# Altium schematic sheet MCU.SchDoc: ESP32 SoC
size 420 x 297 mm; SheetNumber: 9
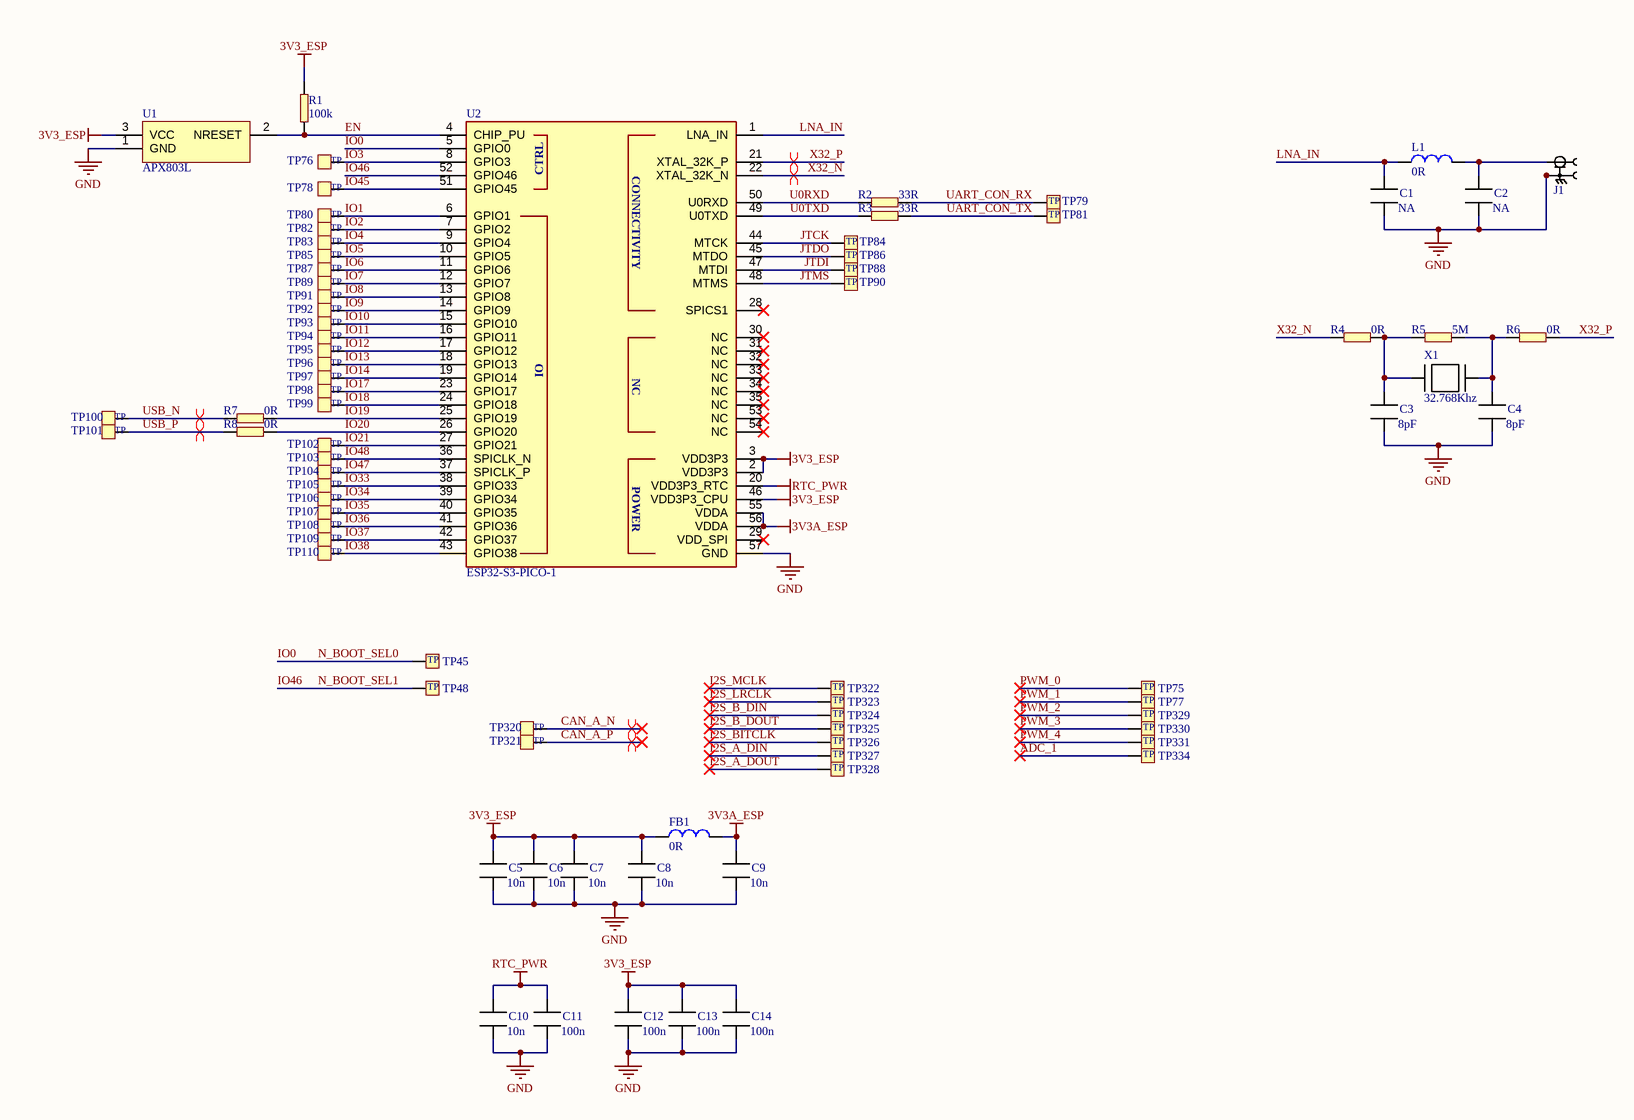
[diagram p0: MCU.SchDoc]

## Parts
C1  value NA  [CAPC0603X03L]  (hidden comment: ERP_102-1)  (no BOM)
C2  value NA  [CAPC0603X03L]  (hidden comment: ERP_102-1)  (no BOM)
C3  value 8pF  [CAPC0603X03L]  (hidden comment: ERP_102-1)  (no BOM)
C4  value 8pF  [CAPC0603X03L]  (hidden comment: ERP_102-1)  (no BOM)
C5  value 10n  [CAPC0603X03L]  (hidden comment: ERP_102-1)
C6  value 10n  [CAPC0603X03L]  (hidden comment: ERP_102-1)
C7  value 10n  [CAPC0603X03L]  (hidden comment: ERP_102-1)
C8  value 10n  [CAPC0603X03L]  (hidden comment: ERP_102-1)
C9  value 10n  [CAPC0603X03L]  (hidden comment: ERP_102-1)
C10  value 10n  [CAPC0603X03L]  (hidden comment: ERP_102-1)
C11  value 100n  [CAPC0603X03L]  (hidden comment: ERP_102-1)
C12  value 100n  [CAPC0603X03L]  (hidden comment: ERP_102-1)
C13  value 100n  [CAPC0603X03L]  (hidden comment: ERP_102-1)
C14  value 100n  [CAPC0603X03L]  (hidden comment: ERP_102-1)
FB1  value 0R  [INDC0603X03L]  (hidden comment: ERP_103-3)
J1  ERP_148-1  [uFL_50R]  (value not drawn)
L1  value 0R  [IND_0603]  (hidden comment: ERP_103-3)
R1  value 100k  [RESC0603X03L]  (hidden comment: ERP_101-1)
R2  value 33R  [RESC0603X03L]  (hidden comment: ERP_101-1)
R3  value 33R  [RESC0603X03L]  (hidden comment: ERP_101-1)
R4  value 0R  [RESC0603X03L]  (hidden comment: ERP_101-1)
R5  value 5M  [RESC0603X03L]  (hidden comment: ERP_101-1)  (no BOM)
R6  value 0R  [RESC0603X03L]  (hidden comment: ERP_101-1)
R7  value 0R  [RESC0603X03L]  (hidden comment: ERP_101-1)
R8  value 0R  [RESC0603X03L]  (hidden comment: ERP_101-1)
TP45  TP_0P8MM  [TP_0P8MM]  (value not drawn)  (no BOM)
TP48  TP_0P8MM  [TP_0P8MM]  (value not drawn)  (no BOM)
TP75  TP_0P8MM  [TP_0P8MM]  (value not drawn)  (no BOM)
TP76  TP_0P8MM  [TP_0P8MM]  (value not drawn)  (no BOM)
TP77  TP_0P8MM  [TP_0P8MM]  (value not drawn)  (no BOM)
TP78  TP_0P8MM  [TP_0P8MM]  (value not drawn)  (no BOM)
TP79  TP_0P8MM  [TP_0P8MM]  (value not drawn)  (no BOM)
TP80  TP_0P8MM  [TP_0P8MM]  (value not drawn)  (no BOM)
TP81  TP_0P8MM  [TP_0P8MM]  (value not drawn)  (no BOM)
TP82  TP_0P8MM  [TP_0P8MM]  (value not drawn)  (no BOM)
TP83  TP_0P8MM  [TP_0P8MM]  (value not drawn)  (no BOM)
TP84  TP_0P8MM  [TP_0P8MM]  (value not drawn)  (no BOM)
TP85  TP_0P8MM  [TP_0P8MM]  (value not drawn)  (no BOM)
TP86  TP_0P8MM  [TP_0P8MM]  (value not drawn)  (no BOM)
TP87  TP_0P8MM  [TP_0P8MM]  (value not drawn)  (no BOM)
TP88  TP_0P8MM  [TP_0P8MM]  (value not drawn)  (no BOM)
TP89  TP_0P8MM  [TP_0P8MM]  (value not drawn)  (no BOM)
TP90  TP_0P8MM  [TP_0P8MM]  (value not drawn)  (no BOM)
TP91  TP_0P8MM  [TP_0P8MM]  (value not drawn)  (no BOM)
TP92  TP_0P8MM  [TP_0P8MM]  (value not drawn)  (no BOM)
TP93  TP_0P8MM  [TP_0P8MM]  (value not drawn)  (no BOM)
TP94  TP_0P8MM  [TP_0P8MM]  (value not drawn)  (no BOM)
TP95  TP_0P8MM  [TP_0P8MM]  (value not drawn)  (no BOM)
TP96  TP_0P8MM  [TP_0P8MM]  (value not drawn)  (no BOM)
TP97  TP_0P8MM  [TP_0P8MM]  (value not drawn)  (no BOM)
TP98  TP_0P8MM  [TP_0P8MM]  (value not drawn)  (no BOM)
TP99  TP_0P8MM  [TP_0P8MM]  (value not drawn)  (no BOM)
TP100  TP_0P8MM  [TP_0P8MM]  (value not drawn)  (no BOM)
TP101  TP_0P8MM  [TP_0P8MM]  (value not drawn)  (no BOM)
TP102  TP_0P8MM  [TP_0P8MM]  (value not drawn)  (no BOM)
TP103  TP_0P8MM  [TP_0P8MM]  (value not drawn)  (no BOM)
TP104  TP_0P8MM  [TP_0P8MM]  (value not drawn)  (no BOM)
TP105  TP_0P8MM  [TP_0P8MM]  (value not drawn)  (no BOM)
TP106  TP_0P8MM  [TP_0P8MM]  (value not drawn)  (no BOM)
TP107  TP_0P8MM  [TP_0P8MM]  (value not drawn)  (no BOM)
TP108  TP_0P8MM  [TP_0P8MM]  (value not drawn)  (no BOM)
TP109  TP_0P8MM  [TP_0P8MM]  (value not drawn)  (no BOM)
TP110  TP_0P8MM  [TP_0P8MM]  (value not drawn)  (no BOM)
TP320  TP_0P8MM  [TP_0P8MM]  (value not drawn)  (no BOM)
TP321  TP_0P8MM  [TP_0P8MM]  (value not drawn)  (no BOM)
TP322  TP_0P8MM  [TP_0P8MM]  (value not drawn)  (no BOM)
TP323  TP_0P8MM  [TP_0P8MM]  (value not drawn)  (no BOM)
TP324  TP_0P8MM  [TP_0P8MM]  (value not drawn)  (no BOM)
TP325  TP_0P8MM  [TP_0P8MM]  (value not drawn)  (no BOM)
TP326  TP_0P8MM  [TP_0P8MM]  (value not drawn)  (no BOM)
TP327  TP_0P8MM  [TP_0P8MM]  (value not drawn)  (no BOM)
TP328  TP_0P8MM  [TP_0P8MM]  (value not drawn)  (no BOM)
TP329  TP_0P8MM  [TP_0P8MM]  (value not drawn)  (no BOM)
TP330  TP_0P8MM  [TP_0P8MM]  (value not drawn)  (no BOM)
TP331  TP_0P8MM  [TP_0P8MM]  (value not drawn)  (no BOM)
TP334  TP_0P8MM  [TP_0P8MM]  (value not drawn)  (no BOM)
U1  APX803L  [APX803L]
U2  value ESP32-S3-PICO-1  [QFN40P700X700X106_HS-57N]  (hidden comment: ERP_121-4)
X1  value 32.768Khz  [CRYS_L1.6_W1]  (hidden comment: ERP_111-1)

## Nets
3V3_ESP: C5.1 C6.1 C7.1 C8.1 C12.1 C13.1 C14.1 FB1.1 R1.2 U1.3(VCC) U2.2(VDD3P3) U2.3(VDD3P3) U2.46(VDD3P3_CPU)
3V3A_ESP: C9.1 FB1.2 U2.55(VDDA) U2.56(VDDA)
GND: C1.2 C2.2 C3.2 C4.2 C5.2 C6.2 C7.2 C8.2 C9.2 C10.2 C11.2 C12.2 C13.2 C14.2 J1.2 J1.3 U1.1(GND) U2.57(GND)
RTC_PWR: C10.1 C11.1 U2.20(VDD3P3_RTC)
ADC_1: TP334.1
CAN_A_N: TP320.1
CAN_A_P: TP321.1
EN: R1.1 U1.2(NRESET) U2.4(CHIP_PU)
I2S_A_DIN: TP327.1
I2S_A_DOUT: TP328.1
I2S_B_DIN: TP324.1
I2S_B_DOUT: TP325.1
I2S_BITCLK: TP326.1
I2S_LRCLK: TP323.1
I2S_MCLK: TP322.1
IO0: TP45.1 U2.5(GPIO0)  [also labelled N_BOOT_SEL0]
IO1: TP80.1 U2.6(GPIO1)
IO2: TP82.1 U2.7(GPIO2)
IO3: TP76.1 U2.8(GPIO3)
IO4: TP83.1 U2.9(GPIO4)
IO5: TP85.1 U2.10(GPIO5)
IO6: TP87.1 U2.11(GPIO6)
IO7: TP89.1 U2.12(GPIO7)
IO8: TP91.1 U2.13(GPIO8)
IO9: TP92.1 U2.14(GPIO9)
IO10: TP93.1 U2.15(GPIO10)
IO11: TP94.1 U2.16(GPIO11)
IO12: TP95.1 U2.17(GPIO12)
IO13: TP96.1 U2.18(GPIO13)
IO14: TP97.1 U2.19(GPIO14)
IO17: TP98.1 U2.23(GPIO17)
IO18: TP99.1 U2.24(GPIO18)
IO19: R7.1 U2.25(GPIO19)
IO20: R8.1 U2.26(GPIO20)
IO21: TP102.1 U2.27(GPIO21)
IO33: TP105.1 U2.38(GPIO33)
IO34: TP106.1 U2.39(GPIO34)
IO35: TP107.1 U2.40(GPIO35)
IO36: TP108.1 U2.41(GPIO36)
IO37: TP109.1 U2.42(GPIO37)
IO38: TP110.1 U2.43(GPIO38)
IO45: TP78.1 U2.51(GPIO45)
IO46: TP48.1 U2.52(GPIO46)  [also labelled N_BOOT_SEL1]
IO47: TP104.1 U2.37(SPICLK_P)
IO48: TP103.1 U2.36(SPICLK_N)
JTCK: TP84.1 U2.44(MTCK)
JTDI: TP88.1 U2.47(MTDI)
JTDO: TP86.1 U2.45(MTDO)
JTMS: TP90.1 U2.48(MTMS)
LNA_IN: C1.1 L1.1 U2.1(LNA_IN)
PWM_0: TP75.1
PWM_1: TP77.1
PWM_2: TP329.1
PWM_3: TP330.1
PWM_4: TP331.1
U0RXD: R2.2 U2.50(U0RXD)
U0TXD: R3.2 U2.49(U0TXD)
UART_CON_RX: R2.1 TP79.1
UART_CON_TX: R3.1 TP81.1
USB_N: R7.2 TP100.1
USB_P: R8.2 TP101.1
X32_N: R4.2 U2.22(XTAL_32K_N)
X32_P: R6.1 U2.21(XTAL_32K_P)
NetC2_1: C2.1 J1.1 L1.2
NetC3_1: C3.1 R4.1 R5.2 X1.1
NetC4_1: C4.1 R5.1 R6.2 X1.2

Not connected (* = marked no-connect by the designer): U2 28(SPICS1)* 29(VDD_SPI)* 30(NC)* 31(NC)* 32(NC)* 33(NC)* 34(NC)* 35(NC)* 53(NC)* 54(NC)*

## Layout directives
differential pair: CAN_A_N, CAN_A_P, USB_N, USB_P, X32_N, X32_P

## Notes on the sheet
- PROJECT
- SIZE
- FILE NAME
- A3
- TITLE
- SHEET
- OF
- REV
- (in symbol ESP32-S3-PICO-1) CTRL; CONNECTIVITY; IO; POWER
- (in symbol TP_0P8MM) TP

## Library data of the parts
C1-C14 = MLCC_0201: Chip Capacitor, 2-Leads, Body 0.60x0.30mm, IPC High Density; Package: 0201; Manufacturer 1: *; Manufacturer Part Number 1: *; ERP: *
FB1 = FB_0201: FERRITE BEAD 0201; ERP: *; Manufacturer Part Number 1: *; Manufacturer 1: *; Package: 0201
J1 = uFL_50R: Package: UMCC; Value: *; ERP: *; Manufacturer 1: *; Manufacturer Part Number 1: *; Supplier 1: *; Suuplier Part Number 1: *
L1 = IND_0603: ERP: *; Suuplier Part Number 1: *; Supplier 1: *; Manufacturer Part Number 1: *; Manufacturer 1: *; Package: 0603
R1-R8 = RES_0201: Package: 0201; Manufacturer 1: *; Manufacturer Part Number 1: *; ERP: *
TP45 TP48 TP75-TP110 TP320-TP331 TP334 = TP_0P8MM: OSM Footprint 0P8 LGA Ball
U1 = APX803L: IC SUPERVISOR 1 CHANNEL SOT23; Manufacturer Part Number 1: APX803L20-33SA-7; Manufacturer 1: Diodes Incorporated; Value: APX803L
U2 = ESP32-S3-PICO-1: RF TXRX MOD BLUETOOTH WIFISMD; Manufacturer 1: Espressif Systems; Package: 56-TFQFN; ERP: *
X1 = CRYS_L1.6_W1: CRYSTAL 1P6XW1P0; Manufacturer Part Number 1: ECS-.327-6-16R-TR; Manufacturer 1: ECS Inc.; Package: 1P6_1P0; ERP: *